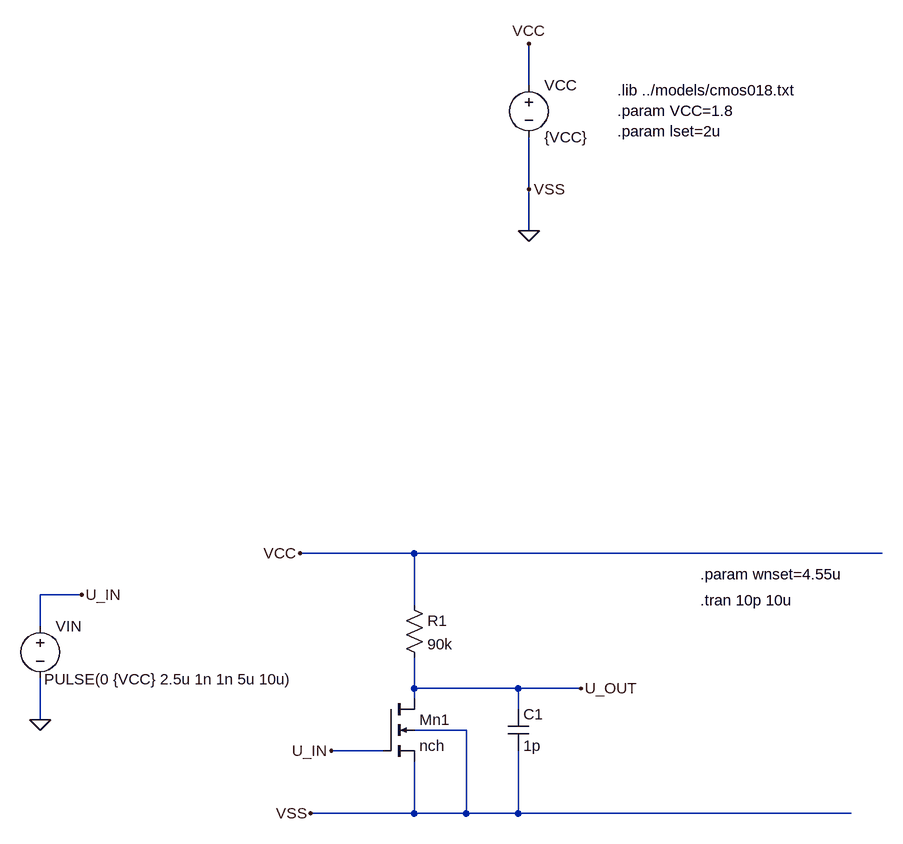
[diagram p0: schematic 4-1-3.asc]
4-1-3.asc, the LTspice schematic file:
Version 4
SHEET 1 7274800 2004
WIRE 1072 -544 1072 -608
WIRE 1072 -384 1072 -464
WIRE 1072 -320 1072 -384
WIRE 896 176 720 176
WIRE 1616 176 896 176
WIRE 384 240 320 240
WIRE 896 256 896 176
WIRE 320 288 320 240
WIRE 896 384 896 336
WIRE 1056 384 896 384
WIRE 1152 384 1056 384
WIRE 896 400 896 384
WIRE 1056 416 1056 384
WIRE 320 432 320 368
WIRE 976 448 896 448
WIRE 848 480 768 480
WIRE 896 576 896 496
WIRE 896 576 736 576
WIRE 976 576 976 448
WIRE 976 576 896 576
WIRE 1056 576 1056 480
WIRE 1056 576 976 576
WIRE 1568 576 1056 576
FLAG 1072 -320 0
FLAG 1072 -608 VCC
FLAG 720 176 VCC
FLAG 736 576 VSS
FLAG 1072 -384 VSS
FLAG 1152 384 U_OUT
FLAG 768 480 U_IN
FLAG 384 240 U_IN
FLAG 320 432 0
SYMBOL voltage 1072 -560 R0
WINDOW 123 0 0 Left 0
WINDOW 39 0 0 Left 0
SYMATTR InstName VCC
SYMATTR Value {VCC}
SYMBOL nmos4 848 400 R0
SYMATTR InstName Mn1
SYMATTR Value nch
SYMATTR Value2 l=lset w=wnset
SYMBOL res 880 240 R0
SYMATTR InstName R1
SYMATTR Value 90k
SYMBOL cap 1040 416 R0
SYMATTR InstName C1
SYMATTR Value 1p
SYMBOL voltage 320 272 R0
WINDOW 123 7 126 Left 2
WINDOW 39 0 0 Left 0
WINDOW 3 6 98 Left 2
SYMATTR Value PULSE(0 {VCC} 2.5u 1n 1n 5u 10u)
SYMATTR InstName VIN
TEXT 1208 -536 Left 2 !.lib ../models/cmos018.txt\n.param VCC=1.8\n.param lset=2u
TEXT 1336 208 Left 2 !.param wnset=4.55u
TEXT 1336 248 Left 2 !.tran 10p 10u

The netlist it stands for:
* 4-1-3.asc
VCC VCC 0 {VCC}
Mn1 U_OUT U_IN 0 0 nch l=lset w=wnset
R1 VCC U_OUT 90k
C1 U_OUT 0 1p
VIN U_IN 0 PULSE(0 {VCC} 2.5u 1n 1n 5u 10u)
.model NMOS NMOS
.model PMOS PMOS
.lib standard.mos
.lib ../models/cmos018.txt
.param VCC=1.8
.param lset=2u
.param wnset=4.55u
.tran 10p 10u
.backanno
.end